# EAGLE design AlarmLeuchte (EAGLE 9.6.2)
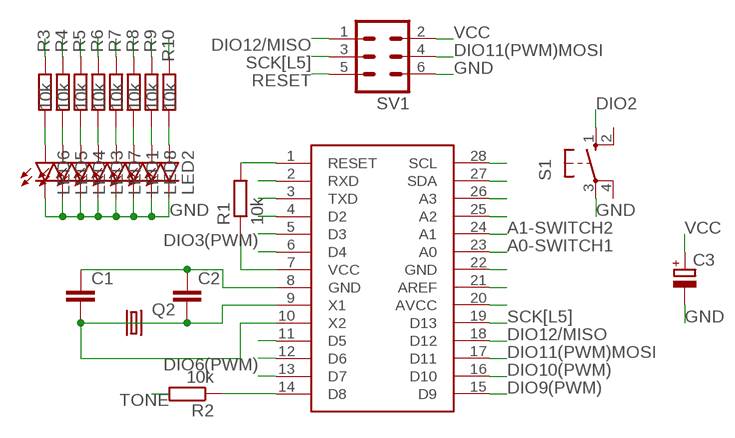
[diagram p0: schematic, sheet 1]

## Parts
C1  C-EU025-024X044  [C025-024X044]
C2  C-EU025-024X044  [C025-024X044]
C3  CPOL-EUE3.5-8  [E3,5-8]
LED1  LED5MM  [LED5MM]
LED2  LED5MM  [LED5MM]
LED3  LED5MM  [LED5MM]
LED4  LED5MM  [LED5MM]
LED5  LED5MM  [LED5MM]
LED6  LED5MM  [LED5MM]
LED7  LED5MM  [LED5MM]
LED8  LED5MM  [LED5MM]
Q2  CRYSTALHC49S  [HC49/S]
R1  10k  R-EU_0207/15  [0207/15]
R2  10k  R-EU_0207/10  [0207/10]
R3  10k  R-EU_0207/10  [0207/10]
R4  10k  R-EU_0207/10  [0207/10]
R5  10k  R-EU_0207/10  [0207/10]
R6  10k  R-EU_0207/10  [0207/10]
R7  10k  R-EU_0207/10  [0207/10]
R8  10k  R-EU_0207/10  [0207/10]
R9  10k  R-EU_0207/10  [0207/10]
R10  10k  R-EU_0204/7  [0204/7]
S1  10-XX  [B3F-10XX]
SV1  MA03-2  [MA03-2]
U$1  ATMEGA328P-PU  [DIL28-3]

## Nets
A0-SWITCH1: U$1.23(A0)
A1-SWITCH2: U$1.24(A1)
A3: U$1.26(A3)
A4[SDA]: U$1.27(SDA)
A5[SCL]: R9.1 U$1.28(SCL)
AREF: U$1.21(AREF)
DIO1(TX): U$1.3(TXD)
DIO2: S1.1(S) U$1.4(D2) U$1.25(A2)
DIO3(PWM): R8.1 U$1.5(D3)
DIO4: R7.1 U$1.6(D4)
DIO5(PWM): R5.1 U$1.11(D5)
DIO6(PWM): R10.1 U$1.12(D6)
DIO7: R3.1 U$1.13(D7)
DIO8: R2.1 U$1.14(D8)
DIO9(PWM): R4.1 U$1.15(D9)
DIO10(PWM): R6.1 U$1.16(D10)
DIO11(PWM)MOSI: SV1.4 U$1.17(D11)
DIO12/MISO: SV1.1 U$1.18(D12)
DPIO0(RX): U$1.2(RXD)
GND: C1.1 C2.1 C3.- LED1.K(C) LED2.K(C) LED3.K(C) LED4.K(C) LED5.K(C) LED6.K(C) LED7.K(C) LED8.K(C) S1.3(P) SV1.6 U$1.8(GND) U$1.22(GND)
N$1: LED6.A R3.2
N$2: LED5.A R4.2
N$3: LED4.A R5.2
N$4: LED3.A R6.2
N$5: LED7.A R7.2
N$6: LED1.A R8.2
N$7: LED8.A R9.2
N$8: LED2.A R10.2
RESET: R1.2 SV1.5 U$1.1(RESET)
SCK[L5]: SV1.3 U$1.19(D13)
TONE: R2.2
VCC: C3.+ R1.1 SV1.2 U$1.7(VCC) U$1.20(AVCC)
X1: C2.2 Q2.1 U$1.9(X1)
X2: C1.2 Q2.2 U$1.10(X2)
Unconnected: S1.2(S1) S1.4(P1)

## Library data of the parts
C1 C2 = rcl:C-EU: CAPACITOR, European symbol
C3 = rcl:CPOL-EU: POLARIZED CAPACITOR, European symbol; SPICEPREFIX: C
LED1-LED8 = led:LED: LED OSRAM: - CHIPLED LG R971, LG N971, LY N971, LG Q971, LY Q971, LO R971, LY R971 LH N974, LH R974 LS Q976, LO Q976, LY Q976 LO Q996 - Hyper CHIPLED LW Q18S LB Q993, LB Q99A, LB R99A - SideLED LS A670, LO A670, LY A670, LG A670, LP A670 LB A673, LV A673, LT A673, LW A673 LH A674 LY A675 LS A676, LA A676, LO A676, LY A676, LW A676 LS A679, LY A679, LG A679 - Hyper Micro SIDELED® LS Y876, LA Y876, LO Y876, LY Y876 LT Y87S - SmartLED LW L88C, LW L88S LB L89C, LB L89S, LG L890 LS L89K, LO L89K, LY L89K LS L896, LA L896, LO L896, LY L896 - TOPLED LS T670, LO T670, LY T670, LG T670, LP T670 LSG T670, LSP T670, LSY T670, LOP T670, LYG T670 LG T671, LOG T671, LSG T671 LB T673, LV T673, LT T673, LW T673 LH T674 LS T676, LA T676, LO T676, LY T676, LB T676, LH T676, LSB T676, LW T676 LB T67C, LV T67C, LT T67C, LS T67K, LO T67K, LY T67K, LW E67C LS E67B, LA E67B, LO E67B, LY E67B, LB E67C, LV E67C, LT E67C LW T67C LS T679, LY T679, LG T679 LS T770, LO T770, LY T770, LG T770, LP T770 LB T773, LV T773, LT T773, LW T773 LH T774 LS E675, LA E675, LY E675, LS T675 LS T776, LA T776, LO T776, LY T776, LB T776 LHGB T686 LT T68C, LB T68C - Hyper Mini TOPLED® LB M676 - Mini TOPLED Santana® LG M470 LS M47K, LO M47K, LY M47K Source: http://www.osram.convergy.de LUXEON: - LUMILED® LXK2-PW12-R00, LXK2-PW12-S00, LXK2-PW14-U00, LXK2-PW14-V00 LXK2-PM12-R00, LXK2-PM12-S00, LXK2-PM14-U00 LXK2-PE12-Q00, LXK2-PE12-R00, LXK2-PE12-S00, LXK2-PE14-T00, LXK2-PE14-U00 LXK2-PB12-K00, LXK2-PB12-L00, LXK2-PB12-M00, LXK2-PB14-N00, LXK2-PB14-P00, LXK2-PB14-Q00 LXK2-PR12-L00, LXK2-PR12-M00, LXK2-PR14-Q00, LXK2-PR14-R00 LXK2-PD12-Q00, LXK2-PD12-R00, LXK2-PD12-S00 LXK2-PH12-R00, LXK2-PH12-S00 LXK2-PL12-P00, LXK2-PL12-Q00, LXK2-PL12-R00 Source: www.luxeon.com KINGBRIGHT: KA-3528ASYC Source: www.kingbright.com
Q2 = crystal:CRYSTAL: CRYSTAL; OC_FARNELL: 1667008; OC_NEWARK: unknown
R1-R10 = rcl:R-EU_: RESISTOR, European symbol
S1 = switch-omron:10-XX: OMRON SWITCH; MPN: B3F-1000; OC_FARNELL: 176432; OC_NEWARK: 36M3542
SV1 = con-lstb:MA03-2: PIN HEADER; OC_FARNELL: unknown; OC_NEWARK: unknown
U$1 = atmel2:ATMEGA328P-PU

## Board
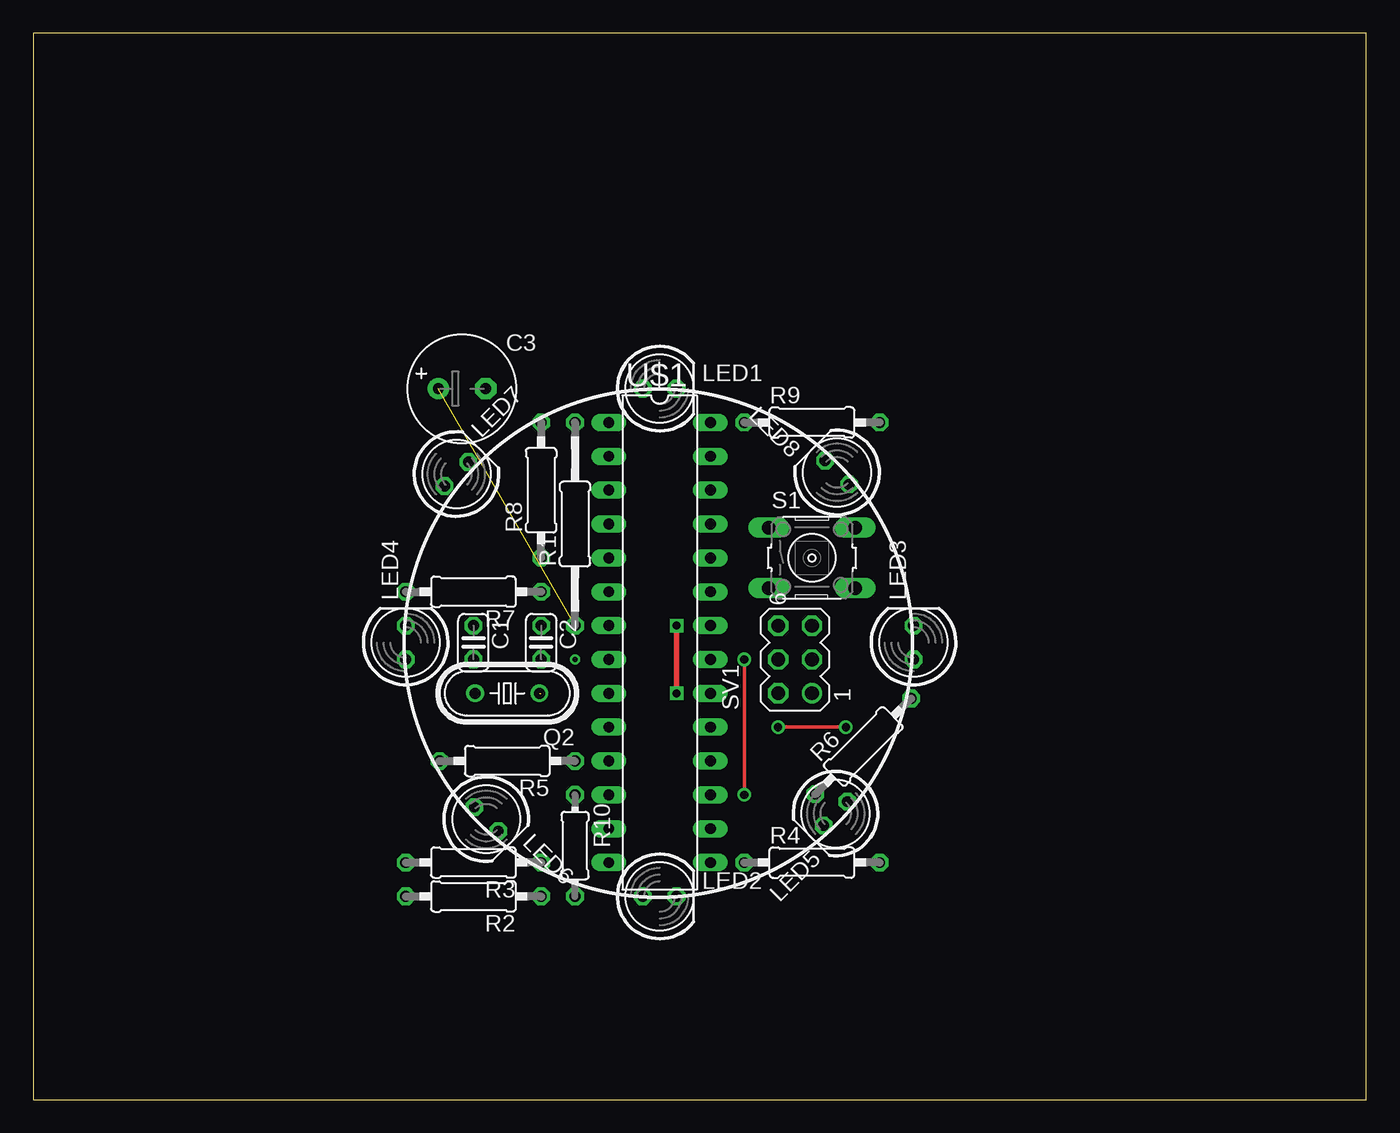
[diagram p1: board, top side]
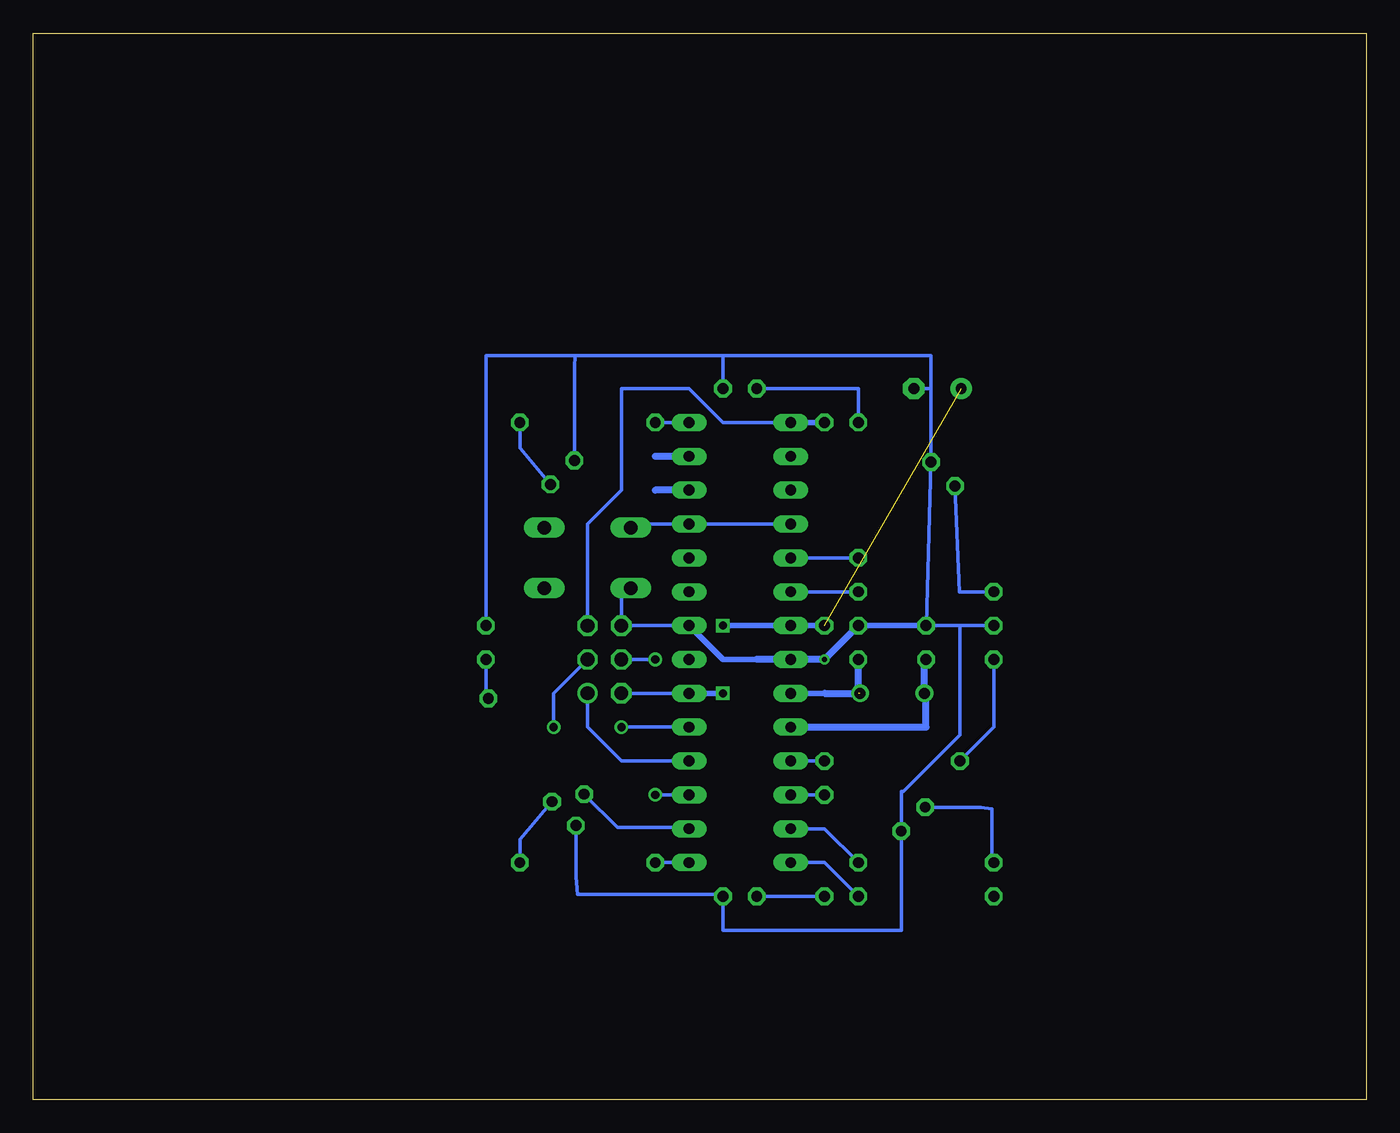
[diagram p2: board, bottom side, seen from below]

Size 100 x 80 mm. Coordinates in mm from the lower left corner, seen from the top.
Outline: 0,0 100,0 100,80 0,80 0,0
Copper layers (1*16): Top 0.035mm / dielectric 1.5mm / Bottom 0.035mm
Design rules "default": minimum track width 10mil, minimum drill 24mil, track to track 8mil, track to pad 8mil, pad to pad 8mil, via to via 8mil, smd to smd 8mil, copper to edge 40mil, drill to drill 8mil, minimum pad ring 10mil, minimum via ring 8mil, stop-mask expansion 4mil, vias tented up to drill 0mil, thermal gap 10mil

### Footprints (pad centres in the part's own frame; a part is rotated, then mirrored left to right if it is on the bottom)
C025-024X044 = drill 0.813 octagon: 1 -1.27,0; 2 1.27,0
E3,5-8 = drill 0.813 pad 1.6: + -1.778,0 | drill 0.813 pad 1.6 octagon: - 1.778,0
LED5MM = drill 0.813 octagon: A -1.27,0; K 1.27,0
HC49/S = drill 0.813: 1 -2.413,0; 2 2.413,0
0207/15 = drill 0.813 octagon: 1 -7.62,0; 2 7.62,0
0207/10 = drill 0.813 octagon: 1 -5.08,0; 2 5.08,0
0204/7 = drill 0.813 octagon: 1 -3.81,0; 2 3.81,0
B3F-10XX = drill 1.016 long: 1 -3.251,2.261; 2 3.251,2.261; 3 -3.251,-2.261; 4 3.251,-2.261
MA03-2 = drill 1.016: 1 -2.54,-1.27 | drill 1.016 octagon: 2 -2.54,1.27; 3 0,-1.27; 4 0,1.27; 5 2.54,-1.27; 6 2.54,1.27
DIL28-3 = drill 0.813 long: 1 -16.51,-3.81; 2 -13.97,-3.81; 3 -11.43,-3.81; 4 -8.89,-3.81; 5 -6.35,-3.81; 6 -3.81,-3.81; 7 -1.27,-3.81; 8 1.27,-3.81; 9 3.81,-3.81; 10 6.35,-3.81; 11 8.89,-3.81; 12 11.43,-3.81; 13 13.97,-3.81; 14 16.51,-3.81; 15 16.51,3.81; 16 13.97,3.81; 17 11.43,3.81; 18 8.89,3.81; 19 6.35,3.81; 20 3.81,3.81; 21 1.27,3.81; 22 -1.27,3.81; 23 -3.81,3.81; 24 -6.35,3.81; 25 -8.89,3.81; 26 -11.43,3.81; 27 -13.97,3.81; 28 -16.51,3.81

### Placement (x,y rotation side)
C1  33.02,34.29 270 top
C2  38.1,34.29 270 top
C3  32.16,53.34 0 top
LED1  46.99,53.34 0 top
LED2  46.99,15.24 0 top
LED3  66.04,34.29 90 top
LED4  27.94,34.29 90 top
LED5  60.19,21.45 225 top
LED6  33.98,21.04 315 top
LED7  31.75,46.93 45 top
LED8  60.3,47.05 135 top
Q2  35.56,30.48 180 top
R1  40.64,43.18 90 top
R2  33.02,15.24 180 top
R3  33.02,17.78 180 top
R4  58.42,17.78 0 top
R5  35.56,25.4 180 top
R6  62.27,26.5 45 top
R7  33.02,38.1 180 top
R8  38.1,45.72 90 top
R9  58.42,50.8 0 top
R10  40.64,19.05 270 top
S1  58.42,40.64 0 top
SV1  57.15,33.02 90 top
U$1  46.99,34.29 270 top

### Tracks (layer width: path | path; a pad name or v marks a point on that pad's centre or on a via)
A3
  Bottom 0.508: U$1.26 53.34,45.72
A4[SDA]
  Bottom 0.508: U$1.27 53.34,48.26
A5[SCL]
  Bottom 0.254: R9.1 U$1.28
DIO2
  Bottom 0.254: U$1.4 U$1.25 54.89,43.18 S1.1
DIO3(PWM)
  Bottom 0.254: R8.1 U$1.5
DIO4
  Bottom 0.254: R7.1 U$1.6
DIO5(PWM)
  Bottom 0.254: U$1.11 R5.1
DIO6(PWM)
  Bottom 0.254: U$1.12 R10.1
DIO7
  Bottom 0.254: R3.1 40.64,20.32 U$1.13
DIO8
  Bottom 0.254: U$1.14 40.64,17.78 R2.1
DIO9(PWM)
  Bottom 0.254: U$1.15 R4.1
DIO10(PWM)
  Bottom 0.254: R6.1 56.19,20.42 50.9,20.42 U$1.16
DIO11(PWM)MOSI  (via drill 0.61)
  Top 0.254: v53.34,33.02 v53.34,22.86
  Bottom 0.254: SV1.4 v53.34,33.02 | v53.34,22.86 U$1.17
DIO12/MISO
  Bottom 0.254: SV1.1 58.42,27.94 55.88,25.4 U$1.18
GND  (via drill 0.35)
  Bottom 0.254: U$1.22 SV1.6 55.88,37.67 S1.3 | 30.48,35.56 30.48,27.37 34.72,23.14 34.88,23.12 LED6.K 34.88,12.7 48.26,12.7 LED2.K 48.4,15.38 59.17,15.38 59.29,16.71 LED5.K | 30.48,35.56 LED4.K | 48.26,55.81 59.37,55.81 | 59.37,55.81 59.41,54.94 LED8.K | 32.65,53.34 LED7.K 32.98,35.6 C1.1 30.48,35.56 | 32.65,53.34 32.65,55.45 32.67,55.81 48.26,55.81 | 48.26,55.81 LED1.K | LED3.K 66.04,55.81 59.37,55.81 | C3.- 32.65,53.34
  Bottom 0.406: C2.1 C1.1 | 45.72,33.02 48.26,33.02 U$1.22
  Bottom 0.508: 45.72,33.02 U$1.8 v40.64,33.02 C2.1
N$1
  Bottom 0.254: R3.2 28.08,17.92 28.08,21.8 28.92,21.93 LED6.A
N$2
  Bottom 0.254: LED5.A 63.5,19.5 R4.2
N$3
  Bottom 0.254: R5.2 27.94,27.94 LED4.A
N$4
  Bottom 0.254: LED3.A 66.04,30.14 R6.2
N$5
  Bottom 0.254: R7.2 30.53,38.1 LED7.A
N$6
  Bottom 0.254: R8.2 38.1,53.34 LED1.A
N$7
  Bottom 0.254: R9.2 63.5,48.87 LED8.A
N$8
  Bottom 0.254: R10.2 LED2.A
RESET
  Bottom 0.254: U$1.1 48.26,50.8 50.8,53.34 55.88,53.34 55.88,45.72 58.42,43.18 SV1.5
  Bottom 0.406: U$1.1 R1.2
SCK[L5]  (via drill 0.61)
  Top 0.254: v55.88,27.94 v60.96,27.94
  Bottom 0.254: v60.96,27.94 60.96,30.48 SV1.3 | U$1.19 v55.88,27.94
VCC  (via drill 0.6)  (1 unrouted)
  Top 0.406: v48.26,35.56 v48.26,30.48
  Bottom 0.254: U$1.20 SV1.2
  Bottom 0.406: v48.26,35.56 U$1.7 R1.1 | v48.26,30.48 U$1.20
X1  (1 unrouted)
  Bottom 0.406: U$1.9 40.64,30.48
  Bottom 0.508: 40.64,30.48 38.1,30.48 | Q2.1 38.1,30.61 C2.2
X2
  Bottom 0.508: U$1.10 33.02,27.94 33.02,30.35 Q2.2 33.15,32.89 C1.2

### Text on the board
Document: A5[SCL] | DPIO0(RX) | A4[SDA] | DIO1(TX) | A3 | DIO2 | A2 | DIO3(PWM) | A1 | DIO4 | A0 | AREF | SCK | DIO5(PWM) | DIO12/MISO | DIO6(PWM) | DIO11(PWM)MOSI | DIO7 | DIO10(PWM) | DIO8 | DIO9(PWM)